# Altium schematic sheet power.SchDoc
size A2
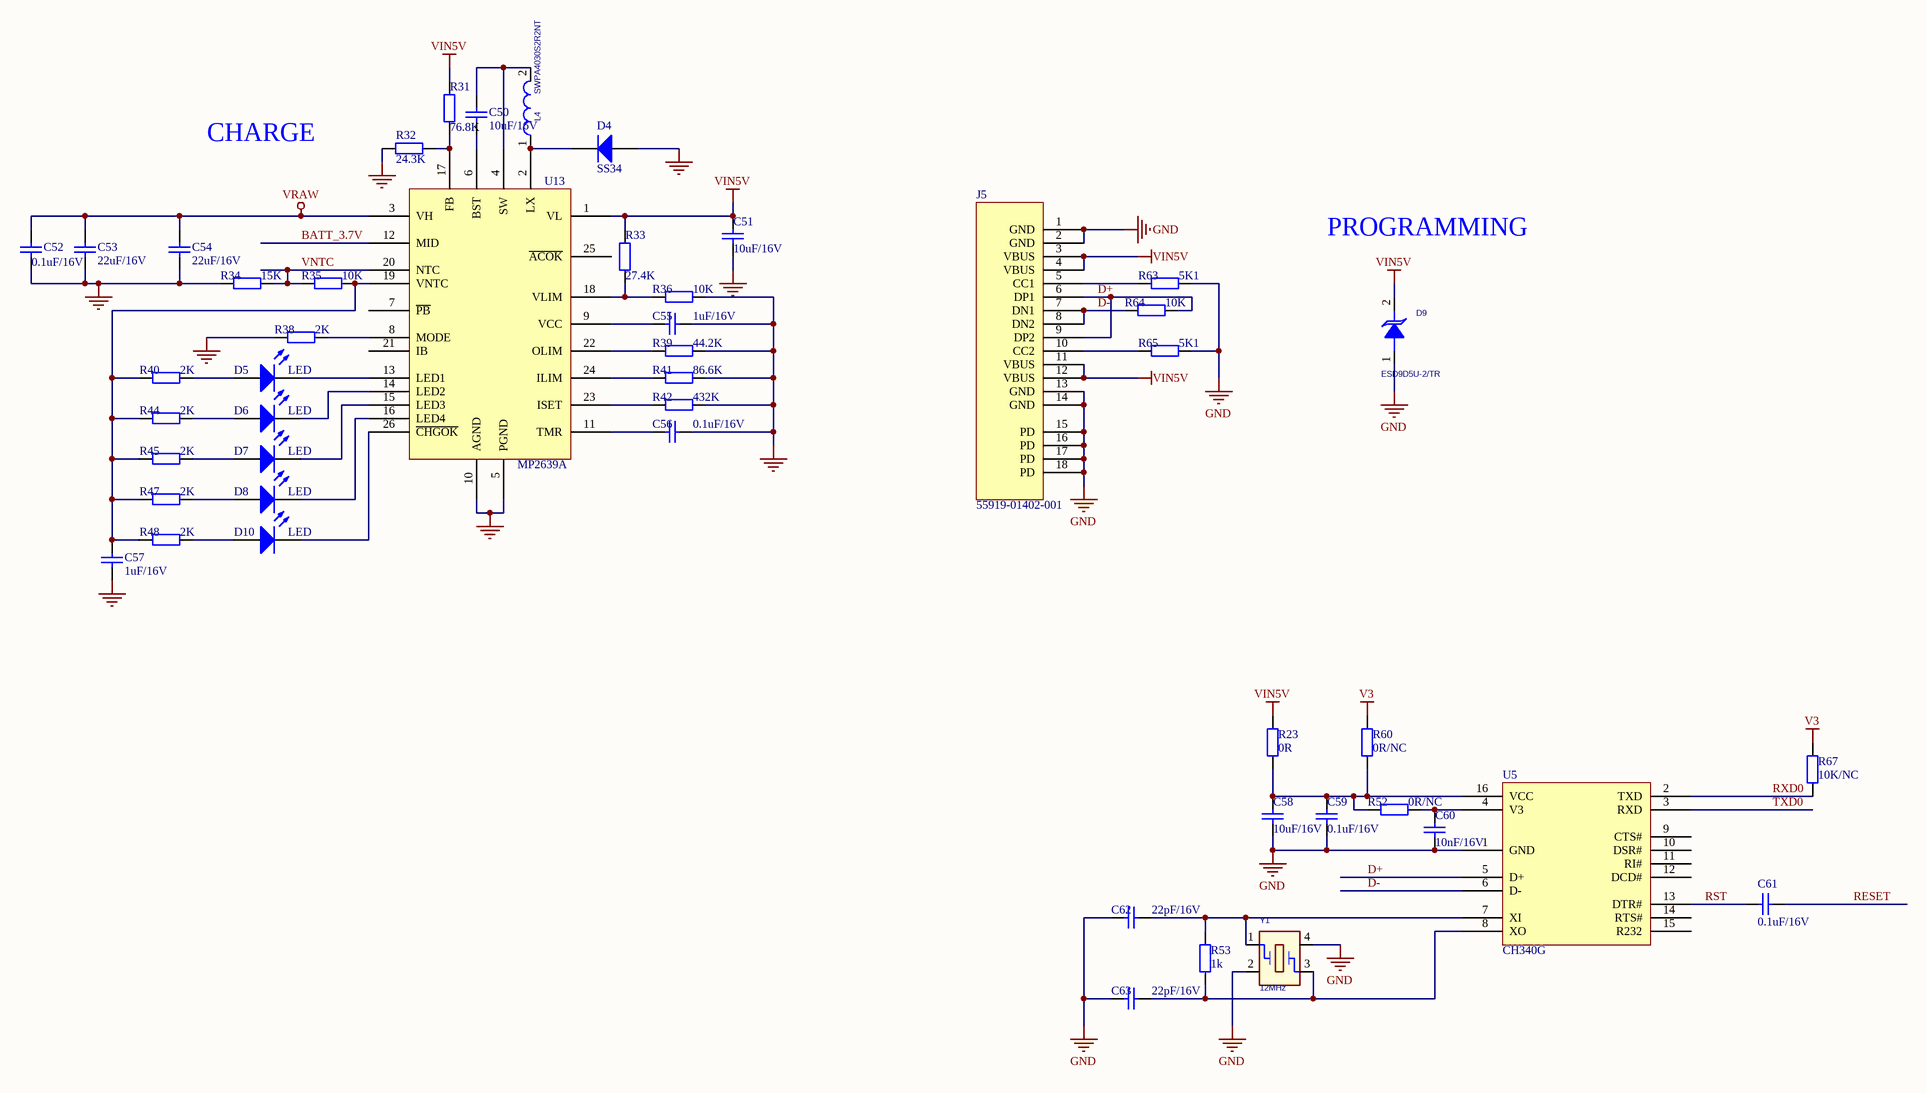
[diagram p0: power.SchDoc]

## Parts
C50  10uF/16V  [CAPC1608N]
C51  10uF/16V  [CAPC1608N]
C52  0.1uF/16V  [CAPC1608N]
C53  22uF/16V  [CAPC2012N]
C54  22uF/16V  [CAPC2012N]
C55  1uF/16V  [CAPC1608N]
C56  0.1uF/16V  [CAPC1608N]
C57  1uF/16V  [CAPC1608N]
C58  10uF/16V  [CAPC1608N]
C59  0.1uF/16V  [CAPC1608N]
C60  10nF/16V  [CAPC1608N]
C61  0.1uF/16V  [CAPC1608N]
C62  22pF/16V  [CAPC1608N]
C63  22pF/16V  [CAPC1608N]
D4  SS34  [SMB]
D5  LED  [0603LED G]
D6  LED  [0603LED G]
D7  LED  [0603LED G]
D8  LED  [0603LED G]
D9  ESD9D5U-2/TR  [sod-923]
D10  LED  [0603LED G]
J5  55919-01402-001  [55919-01402-001]
L4  SWPA4030S2R2NT  [L4X4]
R23  0R  [RESC1608N]
R31  76.8K  [RESC1608N]
R32  24.3K  [RESC1608N]
R33  27.4K  [RESC1608N]
R34  15K  [RESC1608N]
R35  10K  [RESC1608N]
R36  10K  [RESC1608N]
R38  2K  [RESC1608N]
R39  44.2K  [RESC1608N]
R40  2K  [RESC1608N]
R41  86.6K  [RESC1608N]
R42  432K  [RESC1608N]
R44  2K  [RESC1608N]
R45  2K  [RESC1608N]
R47  2K  [RESC1608N]
R48  2K  [RESC1608N]
R52  0R/NC  [RESC1608N]
R53  1k  [RESC1608N]
R60  0R/NC  [RESC1608N]
R63  5K1  [RESC1608N]
R64  10K  [RESC1608N]
R65  5K1  [RESC1608N]
R67  10K/NC  [RESC1608N]
U5  CH340G  [sop16]
U13  MP2639A  [MP2639A]
Y1  12MHz  [XTAL-3225]

## Nets
GND: C51.1 C52.1 C53.1 C54.1 C55.1 C56.1 C57.1 C58.2 C59.2 C60.2 C62.2 C63.2 D4.1(A) D9.1 J5.1(GND) J5.2(GND) J5.13(GND) J5.14(GND) J5.15(PD) J5.16(PD) J5.17(PD) J5.18(PD) R32.1 R34.2 R36.2 R38.2 R39.2 R41.2 R42.2 R63.1 R65.1 U5.1(GND) U13.5(PGND) U13.10(AGND) Y1.2 Y1.4
V3: R60.1 R67.1
VIN5V: C51.2 D9.2 J5.3(VBUS) J5.4(VBUS) J5.11(VBUS) J5.12(VBUS) R23.1 R31.1 R33.1 U13.1(VL)
VRAW: C52.2 C53.2 C54.2 U13.3(VH)
BATT_3.7V: U13.12(MID)
D+: J5.6(DP1) J5.9(DP2) R64.2 U5.5(D+)
D-: J5.7(DN1) J5.8(DN2) R64.1 U5.6(D-)
RESET: C61.2
RST: C61.1 U5.13(DTR#)
RXD0: R67.2 U5.2(TXD)
TXD0: U5.3(RXD)
VNTC: R34.1 R35.2 U13.20(NTC)
NetC50_1: C50.1 U13.6(BST)
NetC50_2: C50.2 L4.2 U13.4(SW)
NetC55_2: C55.2 U13.9(VCC)
NetC56_2: C56.2 U13.11(TMR)
NetC57_2: C57.2 R35.1 R40.2 R44.2 R45.2 R47.2 R48.2 U13.19(VNTC)
NetC58_1: C58.1 C59.1 R23.2 R52.2 R60.2 U5.16(VCC)
NetC60_1: C60.1 R52.1 U5.4(V3)
NetC62_1: C62.1 R53.1 U5.7(XI) Y1.1
NetC63_1: C63.1 R53.2 U5.8(XO) Y1.3
NetD4_2: D4.2(K) L4.1 U13.2(LX)
NetD5_1: D5.1(A) R40.1
NetD5_2: D5.2(K) U13.13(LED1)
NetD6_1: D6.1(A) R44.1
NetD6_2: D6.2(K) U13.14(LED2)
NetD7_1: D7.1(A) R45.1
NetD7_2: D7.2(K) U13.15(LED3)
NetD8_1: D8.1(A) R47.1
NetD8_2: D8.2(K) U13.16(LED4)
NetD10_1: D10.1(A) R48.1
NetD10_2: D10.2(K) U13.26(~{CHGOK})
NetJ5_5: J5.5(CC1) R63.2
NetJ5_10: J5.10(CC2) R65.2
NetR31_2: R31.2 R32.2 U13.17(FB)
NetR33_2: R33.2 R36.1 U13.18(VLIM)
NetR38_1: R38.1 U13.8(MODE)
NetR39_1: R39.1 U13.22(OLIM)
NetR41_1: R41.1 U13.24(ILIM)
NetR42_1: R42.1 U13.23(ISET)

Not connected (* = marked no-connect by the designer): U5 9(CTS#) 10(DSR#) 11(RI#) 12(DCD#) 14(RTS#) 15(R232); U13 7(~{PB}) 21(IB) 25(~{ACOK})

## Notes on the sheet
- CHARGE
- PROGRAMMING

## Library data of the parts
C50-C63 = Cap_2: Capacitor; PackageReference: RAD-0.3; ComponentLink2Description: Datasheet; ComponentLink3Description: DIGIKEY
  C50 C51 C58: Value: 10uF/16V
  C52 C56 C59 C61: Value: 0.1uF/16V
  C53 C54: Value: 22uF/16V
  C55 C57: Value: 1uF/16V
  C60: Value: 10nF/16V
  C62 C63: Value: 22pF/16V
D4 = DIODE: Default Diode; Published: 8-Jun-2000; LatestRevisionDate: 17-Jul-2002; LatestRevisionNote: Re-released for DXP Platform.; Publisher: Altium Limited; Code_JEDEC: DO-214-AB
D5-D8 D10 = LED0: Typical INFRARED GaAs LED; Published: 8-Jun-2000; LatestRevisionDate: 08-Jul-2005; LatestRevisionNote: Mech Layer 1 removed.; PackageReference: LED-0; Publisher: Altium Limited; PackageDescription: LED; 2 Leads
D9 = DIODE_TVS: DIODE TVS ESD PROT ULT LOW CAP 5-5.4V SOD-923; CLASS: IC; AGILE_PN: 480-77934; MFG_NAME01: ON SEMICONDUCTOR; MFG_PN01: ESD9L5.0ST5G; CAD_APPROVED: Yes; ROHS: Yes; HEIGHT: 0.40MM
L4 = IND_2.2uH_2.6A_10%_SMD: Inductor 2.2uH smt 2.6A, 58 milliohm; PartName: 2.2uH10%2.6Asmd; Mfr: TDK; MfrNum: VLCF5020T-2R2N2R6-3; TIIntPartnumber: 1L0025; Vendor: Digikey; Cost100: 1.11; Cost10K: 0.37
R23 R31-R36 R38-R42 R44 R45 R47 R48 R52 R53 R60 R63-R65 R67 = Res2: Resistor; PackageReference: AXIAL-0.4
  R23: Value: 0R; ComponentLink3Description: DIGIKEY
  R31: Value: 76.8K; ComponentLink3Description: DIGIKEY
  R32: Value: 24.3K; ComponentLink3Description: DIGIKEY
  R33: Value: 27.4K; ComponentLink3Description: DIGIKEY
  R34: Value: 15K; ComponentLink3Description: DIGIKEY
  R35 R36 R64: Value: 10K; ComponentLink3Description: DIGIKEY
  R38 R40 R44 R45 R47 R48: Value: 2K; ComponentLink3Description: DIGIKEY
  R39: Value: 44.2K; ComponentLink3Description: DIGIKEY
  R41: Value: 86.6K; ComponentLink3Description: DIGIKEY
  R42: Value: 432K; ComponentLink3Description: DIGIKEY
  R52 R60: Value: 0R/NC; ComponentLink3Description: DIGIKEY
  R53: Published: 8-Jun-2000; LatestRevisionDate: 17-Jul-2002; LatestRevisionNote: Re-released for DXP Platform.; Publisher: Altium Limited; Value: 1k
  R63 R65: Value: 5K1; ComponentLink3Description: DIGIKEY
  R67: Value: 10K/NC; ComponentLink3Description: DIGIKEY
Y1 = XTAL_13Y_A: CLASS: IC